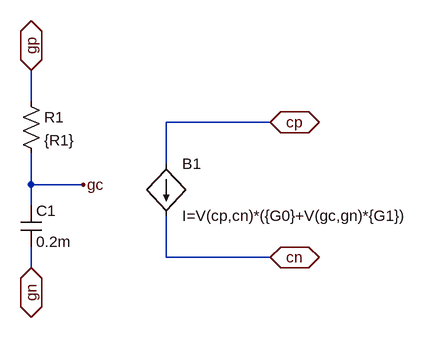
[diagram p0: schematic capteur.asc]
capteur.asc, the LTspice schematic file:
Version 4
SHEET 1 880 680
WIRE -160 16 -160 -32
WIRE 208 48 48 48
WIRE 48 112 48 48
WIRE -160 144 -160 96
WIRE -80 144 -160 144
WIRE -160 176 -160 144
WIRE 48 256 48 192
WIRE 208 256 48 256
WIRE -160 272 -160 240
FLAG 208 256 cn
IOPIN 208 256 BiDir
FLAG 208 48 cp
IOPIN 208 48 BiDir
FLAG -160 -32 gp
IOPIN -160 -32 BiDir
FLAG -160 272 gn
IOPIN -160 272 BiDir
FLAG -80 144 gc
SYMBOL bi 48 112 R0
SYMATTR InstName B1
SYMATTR Value I=V(cp,cn)*({G0}+V(gc,gn)*{G1})
SYMBOL res -176 0 R0
SYMATTR InstName R1
SYMATTR Value {R1}
SYMBOL cap -176 176 R0
SYMATTR InstName C1
SYMATTR Value 0.2m

The netlist it stands for:
* capteur.asc
B1 cp cn I=V(cp,cn)*({G0}+V(gc,gn)*{G1})
R1 gp gc {R1}
C1 gc gn 0.2m
.backanno
.end